# EAGLE design duck-v2 (EAGLE 9.2.1)
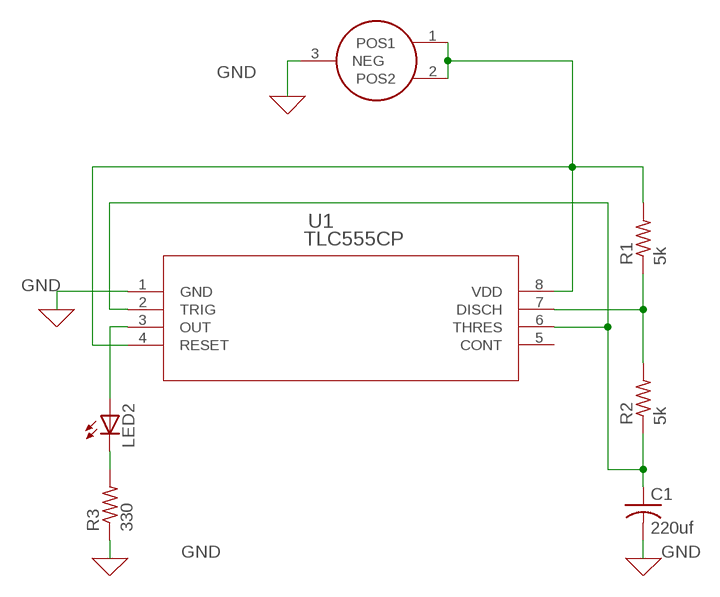
[diagram p0: schematic, sheet 1]

## Parts
C1  220uf  C-US025-024X044  [C025-024X044]
LED2  LED5MM  [LED5MM]
R1  5k  R-US_0204/7  [0204/7]
R2  5k  R-US_0204/7  [0204/7]
R3  330  R-US_0204/7  [0204/7]
U1  TLC555CP  [P8]
U$1  2895  [2895]

## Nets
GND: C1.2 R3.1 U1.1(GND) U$1.3(NEG)
N$1: R1.1 R2.2 U1.7(DISCH)
N$2: LED2.A U1.3(OUT)
N$3: C1.1 R2.1 U1.2(TRIG) U1.6(THRES)
N$4: R1.2 U1.4(RESET) U1.8(VDD) U$1.1(POS1) U$1.2(POS2)
N$6: LED2.K(C) R3.2
Unconnected: U1.5(CONT)

## Library data of the parts
C1 = adafruit:C-US: CAPACITOR, American symbol
LED2 = adafruit:LED: LED OSRAM: - CHIPLED LG R971, LG N971, LY N971, LG Q971, LY Q971, LO R971, LY R971 LH N974, LH R974 LS Q976, LO Q976, LY Q976 LO Q996 - Hyper CHIPLED LW Q18S LB Q993, LB Q99A, LB R99A - SideLED LS A670, LO A670, LY A670, LG A670, LP A670 LB A673, LV A673, LT A673, LW A673 LH A674 LY A675 LS A676, LA A676, LO A676, LY A676, LW A676 LS A679, LY A679, LG A679 - Hyper Micro SIDELED® LS Y876, LA Y876, LO Y876, LY Y876 LT Y87S - SmartLED LW L88C, LW L88S LB L89C, LB L89S, LG L890 LS L89K, LO L89K, LY L89K LS L896, LA L896, LO L896, LY L896 - TOPLED LS T670, LO T670, LY T670, LG T670, LP T670 LSG T670, LSP T670, LSY T670, LOP T670, LYG T670 LG T671, LOG T671, LSG T671 LB T673, LV T673, LT T673, LW T673 LH T674 LS T676, LA T676, LO T676, LY T676, LB T676, LH T676, LSB T676, LW T676 LB T67C, LV T67C, LT T67C, LS T67K, LO T67K, LY T67K, LW E67C LS E67B, LA E67B, LO E67B, LY E67B, LB E67C, LV E67C, LT E67C LW T67C LS T679, LY T679, LG T679 LS T770, LO T770, LY T770, LG T770, LP T770 LB T773, LV T773, LT T773, LW T773 LH T774 LS E675, LA E675, LY E675, LS T675 LS T776, LA T776, LO T776, LY T776, LB T776 LHGB T686 LT T68C, LB T68C - Hyper Mini TOPLED® LB M676 - Mini TOPLED Santana® LG M470 LS M47K, LO M47K, LY M47K Source: http://www.osram.convergy.de/
R1-R3 = adafruit:R-US_: RESISTOR, American symbol
U1 = ducks:TLC555CP; MANUFACTURER_PART_NUMBER: TLC555CP; VENDOR: Texas Instruments
U$1 = ducks:2895

## Board
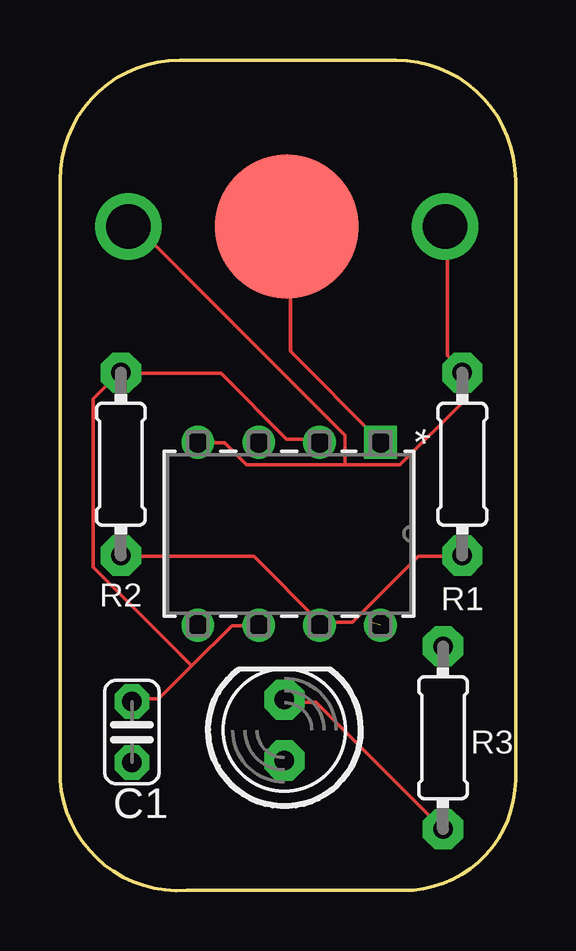
[diagram p1: board, top side]
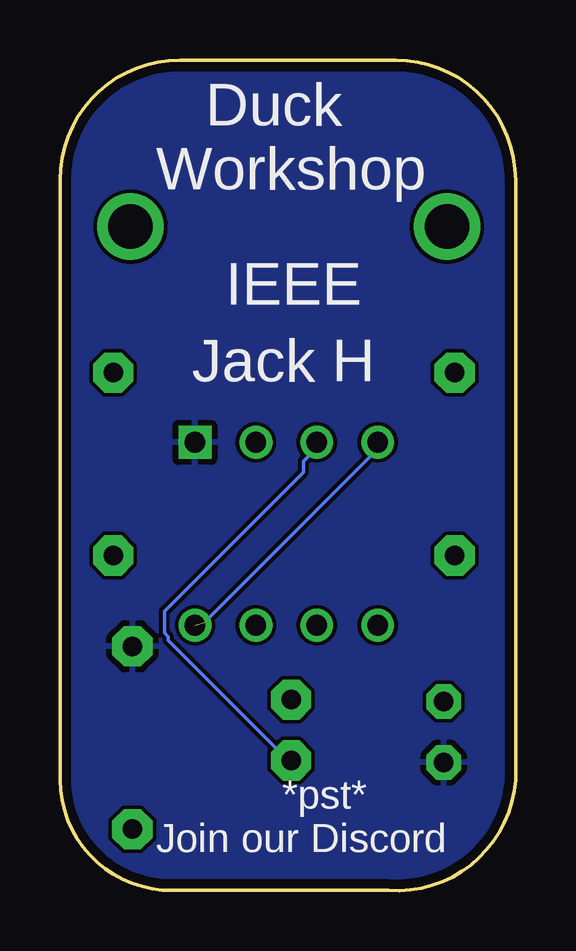
[diagram p2: board, bottom side, seen from below]

Size 19 x 34.61 mm. Coordinates in mm from the lower left corner, seen from the top.
Outline: 14,34.61 5,34.61 arc90 0,29.61 0,4.61 arc90 5.3,0.01 14.3,0.01 arc90 19,4.61 19,29.61 arc90 14,34.61
Copper layers (1*16): Top 0.035559375mm / dielectric 1.6mm / Bottom 0.035559375mm
Design rules "oshpark-2layer": minimum track width 6mil, minimum drill 10mil, track to track 6mil, track to pad 6mil, pad to pad 6mil, via to via 6mil, smd to smd 6mil, copper to edge 15mil, drill to drill 6mil, minimum pad ring 5mil, minimum via ring 5mil, stop-mask expansion 2.5mil, vias tented up to drill 0mil, thermal gap 10mil

### Footprints (pad centres in the part's own frame; a part is rotated, then mirrored left to right if it is on the bottom)
C025-024X044 = drill 0.813 pad 1.422 octagon: 1 -1.27,0; 2 1.27,0
LED5MM = drill 0.813 pad 1.676 octagon: A -1.27,0; K 1.27,0
0204/7 = drill 0.813 pad 1.676 octagon: 1 -3.81,0; 2 3.81,0
P8 = drill 0.864 pad 1.372 square: 1 -7.62,7.62 | drill 0.864 pad 1.372: 2 -7.62,5.08; 3 -7.62,2.54; 4 -7.62,0; 5 0,0; 6 0,2.54; 7 0,5.08; 8 0,7.62
2895 = drill 1.85: 1 -6.6,0; 2 6.6,0 | smd 6 x 6: 3 0,0

### Placement (x,y rotation side)
C1  3,6.61 270 top
LED2  9.36,6.69 90 top
R1  16.78,17.77 90 top
R2  2.54,17.77 270 top
R3  15.97,6.37 270 top
U1  5.75,11.06 270 top
U$1  9.46,27.67 0 top

### Tracks (layer width: path | path; a pad name or v marks a point on that pad's centre or on a via)
GND
  Top 0.152: U$1.3 9.61,27.65 9.61,22.47 13.27,18.81 U1.1
  pour Bottom: 2,-0.39 17,-0.39 20,2.61 20,31.61 16,35.61 3,35.61 -1,31.61 -1,2.61
N$1
  Top 0.152: R1.1 16.77,13.94 14.94,13.94 12.2,11.19 10.98,11.19 U1.7 10.83,11.19 8.09,13.94 2.6,13.94 R2.2
N$2
  Bottom 0.152: U1.3 8.39,18.66 8.39,18.36 8.85,17.9 8.85,17.44 14.64,11.65 14.64,10.74 14.49,10.58 14.49,10.43 9.46,5.4 LED2.A
N$3
  Top 0.152: 5.5,9.37 4.12,7.99 3.06,7.99 C1.1 | 5.5,9.37 7.17,11.04 8.24,11.04 U1.6 | U1.2 10.83,18.81 9.46,18.81 6.71,21.56 2.6,21.56 R2.1 2.45,21.56 1.38,20.49 1.38,13.48 5.5,9.37
N$4  (1 unrouted)
  Top 0.152: 11.9,17.75 14.18,17.75 16.77,20.34 16.77,21.56 R1.2 16.77,21.71 16.16,22.32 16.16,27.65 U$1.2 | 11.9,17.75 7.78,17.75 6.87,18.66 5.8,18.66 U1.4 | 11.9,17.75 11.9,18.97 3.21,27.65 2.9,27.65 U$1.1
  Bottom 0.152: 12.96,11.19 5.8,18.36 5.8,18.66 U1.4
N$6
  Top 0.152: LED2.K 9.46,7.84 10.68,7.84 15.86,2.66 R3.2

### Text on the board
bNames: Duck / Workshop | IEEE | Jack H | *pst* / Join our Discord